# Altium project Control_Board.PrjPcb (part 5 of 7)

## Sheet HB_SENSING.SchDoc
size A4; SheetNumber: 7; SheetTotal: 9
Used 3 times, as channels SEN1, SEN2, SEN3. Parts and nets are listed once, with the designators drawn on the sheet.
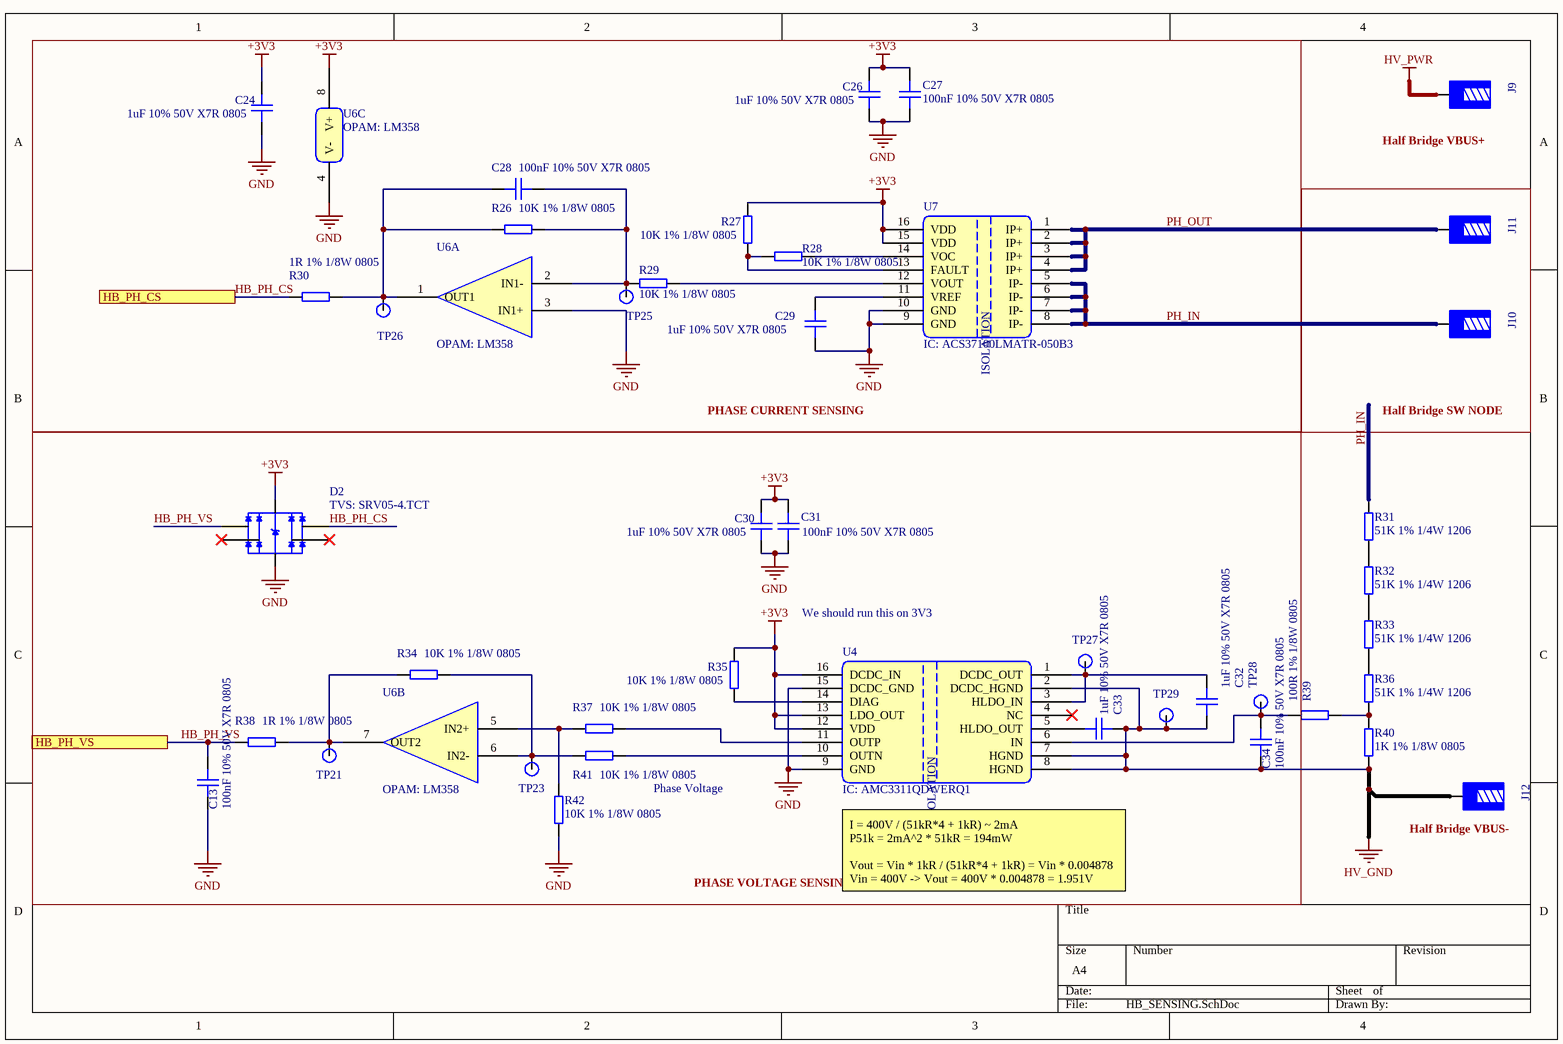
[diagram p5: HB_SENSING.SchDoc]

### Parts
C13  100nF 10% 50V X7R 0805  [CAPC2012X10N]
C24  1uF 10% 50V X7R 0805  [CAPC2012X10N]
C26  1uF 10% 50V X7R 0805  [CAPC2012X10N]
C27  100nF 10% 50V X7R 0805  [CAPC2012X10N]
C28  100nF 10% 50V X7R 0805  [CAPC2012X10N]
C29  1uF 10% 50V X7R 0805  [CAPC2012X10N]
C30  1uF 10% 50V X7R 0805  [CAPC2012X10N]
C31  100nF 10% 50V X7R 0805  [CAPC2012X10N]
C32  1uF 10% 50V X7R 0805  [CAPC2012X10N]
C33  1uF 10% 50V X7R 0805  [CAPC2012X10N]
C34  100nF 10% 50V X7R 0805  [CAPC2012X10N]
D2  TVS: SRV05-4.TCT  [SMTC-SOT23-6_V]
J9  CON1: M5 PCB Terminal  [CON1: M5 PCB Terminal-Footprint-1]  (value not drawn)
J10  CON1: M5 PCB Terminal  [CON1: M5 PCB Terminal-Footprint-1]  (value not drawn)
J11  CON1: M5 PCB Terminal  [CON1: M5 PCB Terminal-Footprint-1]  (value not drawn)
J12  CON1: M5 PCB Terminal  [CON1: M5 PCB Terminal-Footprint-1]  (value not drawn)
R26  10K 1% 1/8W 0805  [RESC2012X05N]
R27  10K 1% 1/8W 0805  [RESC2012X05N]
R28  10K 1% 1/8W 0805  [RESC2012X05N]
R29  10K 1% 1/8W 0805  [RESC2012X05N]
R30  1R 1% 1/8W 0805  [RESC2012X05N]
R31  51K 1% 1/4W 1206  [RESC3116X06N]
R32  51K 1% 1/4W 1206  [RESC3116X06N]
R33  51K 1% 1/4W 1206  [RESC3116X06N]
R34  10K 1% 1/8W 0805  [RESC2012X05N]
R35  10K 1% 1/8W 0805  [RESC2012X05N]
R36  51K 1% 1/4W 1206  [RESC3116X06N]
R37  10K 1% 1/8W 0805  [RESC2012X05N]
R38  1R 1% 1/8W 0805  [RESC2012X05N]
R39  100R 1% 1/8W 0805  [RESC2012X05N]
R40  1K 1% 1/8W 0805  [RESC2012X05N]
R41  10K 1% 1/8W 0805  [RESC2012X05N]
R42  10K 1% 1/8W 0805  [RESC2012X05N]
TP21  TestPoint  [Test Point-Footprint-1]  (value not drawn)
TP23  TestPoint  [Test Point-Footprint-1]  (value not drawn)
TP25  TestPoint  [Test Point-Footprint-1]  (value not drawn)
TP26  TestPoint  [Test Point-Footprint-1]  (value not drawn)
TP27  TestPoint  [Test Point-Footprint-1]  (value not drawn)
TP28  TestPoint  [Test Point-Footprint-1]  (value not drawn)
TP29  TestPoint  [Test Point-Footprint-1]  (value not drawn)
U4  IC: AMC3311QDWERQ1  [SOIC127P1030X265-16N]
U6  OPAM: LM358  [FP-D0008A-IPC_C]  (parts A,B,C of 3)
U7  IC: ACS37100LMATR-050B3  [SOIC127P1030X265-16N]

### Blocks framed on the sheet
PHASE CURRENT SENSING: C24 C26-C29 R26-R30 TP25 TP26 U6 U7
Half Bridge SW NODE: J10 J11

### Ports
HB_PH_CS (see Control_Board_SCH[3C]), HB_PH_VS (see Control_Board_SCH[3C])

### Nets
+3V3: C24.2 C26.2 C27.2 C30.2 C31.2 D2.5 R27.1 R35.1 U4.12(VDD) U4.13(LDO_OUT) U4.16(DCDC_IN) U6.8(V+) U7.15(VDD) U7.16(VDD)
GND: C13.1 C24.1 C26.1 C27.1 C29.1 C30.1 C31.1 D2.2 R42.1 U4.9(GND) U4.15(DCDC_GND) U6.3(IN1+) U6.4(V-) U7.9(GND) U7.10(GND)
HV_GND: C32.1 C33.1 C34.1 J12.1 R40.1 TP29.1 U4.2(DCDC_HGND) U4.7(HGND) U4.8(HGND)
HV_PWR: J9.1
HB_PH_CS: D2.4 R30.1 ; port HB_PH_CS
HB_PH_VS: C13.2 D2.1 R38.1 ; port HB_PH_VS
PH_IN: J10.1 R31.2 U7.5(IP-) U7.6(IP-) U7.7(IP-) U7.8(IP-)
PH_OUT: J11.1 U7.1(IP+) U7.2(IP+) U7.3(IP+) U7.4(IP+)
NetC28_1: C28.1 R26.1 R30.2 TP26.1 U6.1(OUT1)
NetC28_2: C28.2 R26.2 R29.1 TP25.1 U6.2(IN1-)
NetC29_2: C29.2 U7.11(VREF)
NetC32_2: C32.2 TP27.1 U4.1(DCDC_OUT) U4.3(HLDO_IN)
NetC33_2: C33.2 U4.5(HLDO_OUT)
NetC34_2: C34.2 R39.2 TP28.1 U4.6(IN)
NetR27_2: R27.2 R28.1 U7.13(FAULT)
NetR28_2: R28.2 U7.14(VOC)
NetR29_2: R29.2 U7.12(VOUT)
NetR31_1: R31.1 R32.2
NetR32_1: R32.1 R33.2
NetR33_1: R33.1 R36.2
NetR34_1: R34.1 R38.2 TP21.1 U6.7(OUT2)
NetR34_2: R34.2 R41.1 TP23.1 U6.6(IN2-)
NetR35_2: R35.2 U4.14(DIAG)
NetR36_1: R36.1 R39.1 R40.2
NetR37_1: R37.1 R42.2 U6.5(IN2+)
NetR37_2: R37.2 U4.11(OUTP)
NetR41_2: R41.2 U4.10(OUTN)

Not connected (* = marked no-connect by the designer): D2 3* 6*; U4 4(NC)*

### Channels
SEN1: designators end in _SEN1; ports HB_PH_CS=HB_PH_CS HB_PH_VS=HB_PH_VS
SEN2: designators end in _SEN2; ports HB_PH_CS=HB_PH_CS HB_PH_VS=HB_PH_VS
SEN3: designators end in _SEN3; ports HB_PH_CS=HB_PH_CS HB_PH_VS=HB_PH_VS

### Notes on the sheet
- (near C28) Unitary gain
  fc=1/RC = 1kHz
- (near J9) Half Bridge VBUS+
- We should run this on 3V3
- Phase Voltage
- (near J12) Half Bridge VBUS-
- PHASE VOLTAGE SENSING
- (near U4) I = 400V / (51kR*4 + 1kR) ~ 2mA
  P51k = 2mA^2 * 51kR = 194mW
  Vout = Vin * 1kR / (51kR*4 + 1kR) = Vin * 0.004878
  Vin = 400V -> Vout = 400V * 0.004878 = 1.951V
- (in symbol CMP-001-00097-4) ISOLATION
- (in symbol CMP-00248-1) ISOLATION

### Library data of the parts
C13 C27 C28 C31 C34 = CMP-001-00091-1: Multilayer Ceramic Capacitors MLCC - SMD/SMT 50V 0.1uF X7R 0805 10%; Manufacturer: Stackpole Electronics; Manufacturer Part Number: CML0805X7R104KT50V; Voltage Rating (DC): 50V; REACH SVHC: Yes; Height: 800µm; Min Operating Temperature: -55°C; Dielectric Material: Ceramic; RoHS: Compliant; Number of Terminals: 2; Lifecycle Status: Production; Width: 1.25mm; Length: 2mm; Category: Ceramic Capacitors; Max Operating Temperature: 125°C; Mount: Surface Mount; Capacitance: 100nF
C24 C26 C29 C30 C32 C33 = CMP-001-00047-1: Ceramic Capacitor, Multilayer, Ceramic, 50V, 10% +Tol, 10% -Tol, X7R, 15% TC, 1uF, Surface Mount, 0805; Manufacturer Part Number: C2012X7R1H105K125AB; Manufacturer Lifecycle Status: PRODUCTION; Manufacturer: TDK; Value: 1µF; Export Control Classification Number (ECCN) Code: EAR99; Case/Package: 0805; Max Length: 3.5mm; ComponentLink4Description: https://datasheet.octopart.com:443/C3216X7R1H106K160AC-TDK-datasheet-151546523.pdf?src-supplier=ODG+(Origin+Data+Global); ComponentLink1URL: https://datasheet.octopart.com:443/C3216X7R1H106K160AC-TDK-datasheet-175423548.pdf?src-supplier=TME; Category: Ceramic Capacitors; Voltage Rating (DC): 50V; Case Code (Metric): 2012; Lifecycle Status: Production; Height: 1.6mm; Design Item ID: 1uF 10% 50V X7R 0805; Min Length: 3.1mm; Min Operating Temperature: -55°C; Pricing: 100=3,09, 250=2,81, 500=2,35, 1000=2,2, 2000=1,97 (DKK); Width: 1.6mm; Voltage Rating: 50V; Stock: 26276; ComponentLink2Description: https://datasheet.octopart.com:443/C3216X7R1H106K160AC-TDK-datasheet-182135025.pdf?src-supplier=TME; Harmonized Tariff Schedule (HTS) Code: 8532.24.00.20; ComponentLink3Description: https://datasheet.octopart.com:443/C3216X7R1H106K160AC-TDK-datasheet-159617022.pdf?src-supplier=TME; Thickness: 1.6mm; Max Operating Temperature: 125°C; ComponentLink4URL: https://datasheet.octopart.com:443/C3216X7R1H106K160AC-TDK-datasheet-151546523.pdf?src-supplier=ODG+(Origin+Data+Global); Lead Free: Lead Free; ComponentLink3URL: https://datasheet.octopart.com:443/C3216X7R1H106K160AC-TDK-datasheet-159617022.pdf?src-supplier=TME; ComponentLink1Description: https://datasheet.octopart.com:443/C3216X7R1H106K160AC-TDK-datasheet-175423548.pdf?src-supplier=TME; Max Width: 1.9mm; Dielectric: X7R; RoHS: Compliant; China RoHS: Compliant; REACH SVHC: Yes; ComponentLink2URL: https://datasheet.octopart.com:443/C3216X7R1H106K160AC-TDK-datasheet-182135025.pdf?src-supplier=TME; Length: 3.2mm; ComponentLink5URL: https://datasheet.octopart.com/C3216X7R1H106K160AC-TDK-datasheet-41194876.pdf; Introduction Date: 2018-03-29; Dielectric Material: Ceramic; Min Width: 1.5mm; Number of Terminals: 2; Material: Ceramic; Source: MasterLibrary_SCH.SchLib; Mounting Technology: Surface Mount; ComponentLink5Description: https://datasheet.octopart.com/C3216X7R1H106K160AC-TDK-datasheet-41194876.pdf
D2 = CMP-004-00044-2: SRV Series 17.5 V 3 pF SMT RailClamp® Low Capacitance TVS Diode Array SOT-23-6; Manufacturer: Semtech; Max Power Dissipation: 300W; Value: 5pF; Peak Pulse Current: 12A; Polarity: Unidirectional; Breakdown Voltage: 6V; ESD Protection: Yes; Clamping Voltage: 12.5V; Number of Bidirectional Channels: 4; Current: 5A; Test Current: 1mA; Working Voltage: 5V; Leakage Current: 5µA; Number of Elements: 1; Depth: 1.6mm; China RoHS: Compliant; RoHS: Compliant; Lead Free: Lead Free; Pins: 6; Power Rating: 300W; Packaging: Cut Tape; Max Operating Temperature: 125°C; Min Operating Temperature: -55°C; Length: 2.9mm; Case/Package: SOT-23; Lifecycle Status: Production; REACH SVHC: Yes; Peak Pulse Power: 300W; Height: 1.15mm; Max Breakdown Voltage: 6V; Voltage Rating (DC): 5V; Country of Origin: Mainland China; Radiation Hardening: No; Number of Channels: 4; Width: 1.6mm; Operating Supply Voltage: 5V; Min Breakdown Voltage: 6V; Mounting Technology: Surface Mount; Introduction Date: 2002-08-22; Reverse Breakdown Voltage: 6V; Power Line Protection: Yes; Number of Terminals: 6; Max Reverse Leakage Current: 5µA; Reverse Standoff Voltage: 5V; Direction: Unidirectional; Harmonized Tariff Schedule (HTS) Code: 8541.10.00.50; Schedule B: 8542390000, 8542390000; Export Control Classification Number (ECCN) Code: EAR99; Voltage: 5V; Manufacturer Part Number: SRV05-4.TCT
J9-J12 = CMP-002-00581-1: Manufacturer: Lab; Manufacturer Part Number: M5 PCB Terminal
R26-R29 R34 R35 R37 R41 R42 = CMP-009-00659-2: Res Thick Film 0805 10K Ohm 1% 0.125W ±100ppm/°C Molded SMD Paper T/R; Manufacturer: Stackpole Electronics; Manufacturer Part Number: RMCF0805FT10K0; Power Dissipation: 125mW; Voltage Rating: 150V; Design Item ID: 10K 1% 1/4W 0805; ComponentLink15URL: http://sigma.octopart.com:80/15940719/materials_sheet/Stackpole-Electronics-RMCF0805FT10K0.pdf?src-supplier=Compliance+Statements; ComponentLink13Description: https://datasheet.octopart.com:443/RMCF0805FT10K0-Stackpole-Electronics-datasheet-8088878.pdf?src-supplier=Future+Electronics; Depth: 1.25mm; Number of Terminations: 2; ComponentLink12Description: https://datasheet.octopart.com:443/RMCF0805FT10K0-Stackpole-Electronics-datasheet-8324226.pdf?src-supplier=Future+Electronics; ComponentLink9URL: https://datasheet.octopart.com:443/RMCF0805FT10K0-Stackpole-Electronics-datasheet-11546843.pdf?src-supplier=Arrow+Electronics; ComponentLink4Description: https://datasheet.octopart.com:443/RMCF0805FT10K0-Stackpole-Electronics-datasheet-12510902.pdf?src-supplier=Upverter; China RoHS: Non-Compliant; Contact Plating: Tin; ComponentLink7URL: https://datasheet.octopart.com:443/RMCF0805FT10K0-Stackpole-Electronics-datasheet-10788263.pdf?src-supplier=Stackpole+Electronics; ComponentLink6Description: https://datasheet.octopart.com:443/RMCF0805FT10K0-Stackpole-Electronics-datasheet-62091608.pdf?src-supplier=Stackpole+Electronics; ComponentLink4URL: https://datasheet.octopart.com:443/RMCF0805FT10K0-Stackpole-Electronics-datasheet-12510902.pdf?src-supplier=Upverter; ComponentLink12URL: https://datasheet.octopart.com:443/RMCF0805FT10K0-Stackpole-Electronics-datasheet-8324226.pdf?src-supplier=Future+Electronics; ComponentLink1Description: https://datasheet.octopart.com:443/RMCF0805FT10K0-Stackpole-Electronics-datasheet-182148065.pdf?src-supplier=IHS; ComponentLink3URL: https://datasheet.octopart.com:443/RMCF0805FT10K0-Stackpole-Electronics-datasheet-28504820.pdf?src-supplier=Upverter; Width: 1.25mm; Lifecycle Status: Production; ComponentLink15Description: http://sigma.octopart.com:80/15940719/materials_sheet/Stackpole-Electronics-RMCF0805FT10K0.pdf?src-supplier=Compliance+Statements; Max Operating Temperature: 155°C; ComponentLink8URL: https://datasheet.octopart.com:443/RMCF0805FT10K0-Stackpole-Electronics-datasheet-154799224.pdf?src-supplier=Master+Electronics; ComponentLink16URL: http://sigma.octopart.com:80/141158211/reach_statement/Stackpole-Electronics-RMCF0805FT10K0.pdf?src-supplier=Compliance+Statements; ComponentLink3Description: https://datasheet.octopart.com:443/RMCF0805FT10K0-Stackpole-Electronics-datasheet-28504820.pdf?src-supplier=Upverter; ComponentLink10URL: https://datasheet.octopart.com:443/RMCF0805FT10K0-Stackpole-Electronics-datasheet-11547379.pdf?src-supplier=Future+Electronics; Features: Automotive AEC-Q200; Lead Free: Lead Free; ComponentLink2Description: https://datasheet.octopart.com:443/RMCF0805FT10K0-Stackpole-Electronics-datasheet-12534581.pdf?src-supplier=Upverter; ComponentLink14Description: https://datasheet.octopart.com:443/RMCF0805FT10K0-Stackpole-Electronics-datasheet-5313682.pdf?src-supplier=Future+Electronics; ComponentLink17URL: http://sigma.octopart.com:80/141158212/rohs_statement/Stackpole-Electronics-RMCF0805FT10K0.pdf?src-supplier=Compliance+Statements; Stock: 3420000; ComponentLink5URL: https://datasheet.octopart.com:443/RMCF0805FT10K0-Stackpole-Electronics-datasheet-141193804.pdf?src-supplier=Stackpole+Electronics; ComponentLink11URL: https://datasheet.octopart.com:443/RMCF0805FT10K0-Stackpole-Electronics-datasheet-8359789.pdf?src-supplier=Future+Electronics; Max Power Dissipation: 125mW; ComponentLink10Description: https://datasheet.octopart.com:443/RMCF0805FT10K0-Stackpole-Electronics-datasheet-11547379.pdf?src-supplier=Future+Electronics; Case/Package: 0805; ComponentLink8Description: https://datasheet.octopart.com:443/RMCF0805FT10K0-Stackpole-Electronics-datasheet-154799224.pdf?src-supplier=Master+Electronics; Schedule B: 8533210045, 8533210045; Composition: Thick Film; RoHS: Compliant; ComponentLink17Description: http://sigma.octopart.com:80/141158212/rohs_statement/Stackpole-Electronics-RMCF0805FT10K0.pdf?src-supplier=Compliance+Statements; Case Code (Metric): 2012; Number of Terminals: 2; Military Standard: Not; ComponentLink11Description: https://datasheet.octopart.com:443/RMCF0805FT10K0-Stackpole-Electronics-datasheet-8359789.pdf?src-supplier=Future+Electronics; Height: 500µm; Min Operating Temperature: -55°C; Category: Chip SMD Resistors; Value: 10k; Working Voltage: 150V; Source: MasterLibrary_SCH.SchLib; ComponentLink5Description: https://datasheet.octopart.com:443/RMCF0805FT10K0-Stackpole-Electronics-datasheet-141193804.pdf?src-supplier=Stackpole+Electronics; Length: 2mm; ComponentLink16Description: http://sigma.octopart.com:80/141158211/reach_statement/Stackpole-Electronics-RMCF0805FT10K0.pdf?src-supplier=Compliance+Statements; Tolerance: 1%; Temperature Coefficient: 100ppm/°C; Pricing: 5000=0.00245, 10000=0.00241, 20000=0.00238, 40000=0.00234, 80000=0.0023 (USD); REACH SVHC: Yes; Mounting Technology: Surface Mount; Packaging: Cut Tape (CT); ComponentLink9Description: https://datasheet.octopart.com:443/RMCF0805FT10K0-Stackpole-Electronics-datasheet-11546843.pdf?src-supplier=Arrow+Electronics; Power Rating: 125mW; ComponentLink13URL: https://datasheet.octopart.com:443/RMCF0805FT10K0-Stackpole-Electronics-datasheet-8088878.pdf?src-supplier=Future+Electronics; ComponentLink2URL: https://datasheet.octopart.com:443/RMCF0805FT10K0-Stackpole-Electronics-datasheet-12534581.pdf?src-supplier=Upverter; ComponentLink1URL: https://datasheet.octopart.com:443/RMCF0805FT10K0-Stackpole-Electronics-datasheet-182148065.pdf?src-supplier=IHS; ComponentLink7Description: https://datasheet.octopart.com:443/RMCF0805FT10K0-Stackpole-Electronics-datasheet-10788263.pdf?src-supplier=Stackpole+Electronics; Radiation Hardening: No; ComponentLink6URL: https://datasheet.octopart.com:443/RMCF0805FT10K0-Stackpole-Electronics-datasheet-62091608.pdf?src-supplier=Stackpole+Electronics; ComponentLink14URL: https://datasheet.octopart.com:443/RMCF0805FT10K0-Stackpole-Electronics-datasheet-5313682.pdf?src-supplier=Future+Electronics
R30 R38 = CMP-009-00658-1: Res Thick Film 0805 1 Ohm 1% 0.125W ±100ppm/°C Molded SMD Paper T/R; Manufacturer Part Number: RMCF0805FT1R00; Manufacturer: Stackpole Electronics; Voltage Rating: 150V; Max Power Dissipation: 125mW; Value: 1; RoHS: Compliant; ComponentLink13URL: https://datasheet.octopart.com:443/RMCF0805FT10K0-Stackpole-Electronics-datasheet-8088878.pdf?src-supplier=Future+Electronics; Number of Terminations: 2; ComponentLink11URL: https://datasheet.octopart.com:443/RMCF0805FT10K0-Stackpole-Electronics-datasheet-8359789.pdf?src-supplier=Future+Electronics; Case Code (Metric): 2012; Min Operating Temperature: -55°C; ComponentLink2URL: https://datasheet.octopart.com:443/RMCF0805FT10K0-Stackpole-Electronics-datasheet-12534581.pdf?src-supplier=Upverter; ComponentLink14Description: https://datasheet.octopart.com:443/RMCF0805FT10K0-Stackpole-Electronics-datasheet-5313682.pdf?src-supplier=Future+Electronics; Pricing: 5000=0.00245, 10000=0.00241, 20000=0.00238, 40000=0.00234, 80000=0.0023 (USD); Composition: Thick Film; Category: Chip SMD Resistors; Military Standard: Not; Lead Free: Lead Free; ComponentLink17Description: http://sigma.octopart.com:80/141158212/rohs_statement/Stackpole-Electronics-RMCF0805FT10K0.pdf?src-supplier=Compliance+Statements; Height: 500µm; ComponentLink3URL: https://datasheet.octopart.com:443/RMCF0805FT10K0-Stackpole-Electronics-datasheet-28504820.pdf?src-supplier=Upverter; ComponentLink4URL: https://datasheet.octopart.com:443/RMCF0805FT10K0-Stackpole-Electronics-datasheet-12510902.pdf?src-supplier=Upverter; Stock: 3420000; ComponentLink5Description: https://datasheet.octopart.com:443/RMCF0805FT10K0-Stackpole-Electronics-datasheet-141193804.pdf?src-supplier=Stackpole+Electronics; ComponentLink16Description: http://sigma.octopart.com:80/141158211/reach_statement/Stackpole-Electronics-RMCF0805FT10K0.pdf?src-supplier=Compliance+Statements; Mounting Technology: Surface Mount; ComponentLink9URL: https://datasheet.octopart.com:443/RMCF0805FT10K0-Stackpole-Electronics-datasheet-11546843.pdf?src-supplier=Arrow+Electronics; Lifecycle Status: Production; Schedule B: 8533210045, 8533210045; ComponentLink1URL: https://datasheet.octopart.com:443/RMCF0805FT10K0-Stackpole-Electronics-datasheet-182148065.pdf?src-supplier=IHS; Length: 2mm; ComponentLink14URL: https://datasheet.octopart.com:443/RMCF0805FT10K0-Stackpole-Electronics-datasheet-5313682.pdf?src-supplier=Future+Electronics; ComponentLink4Description: https://datasheet.octopart.com:443/RMCF0805FT10K0-Stackpole-Electronics-datasheet-12510902.pdf?src-supplier=Upverter; ComponentLink11Description: https://datasheet.octopart.com:443/RMCF0805FT10K0-Stackpole-Electronics-datasheet-8359789.pdf?src-supplier=Future+Electronics; ComponentLink8Description: https://datasheet.octopart.com:443/RMCF0805FT10K0-Stackpole-Electronics-datasheet-154799224.pdf?src-supplier=Master+Electronics; Number of Terminals: 2; ComponentLink13Description: https://datasheet.octopart.com:443/RMCF0805FT10K0-Stackpole-Electronics-datasheet-8088878.pdf?src-supplier=Future+Electronics; Packaging: Cut Tape (CT); Power Rating: 125mW; ComponentLink17URL: http://sigma.octopart.com:80/141158212/rohs_statement/Stackpole-Electronics-RMCF0805FT10K0.pdf?src-supplier=Compliance+Statements; ComponentLink10Description: https://datasheet.octopart.com:443/RMCF0805FT10K0-Stackpole-Electronics-datasheet-11547379.pdf?src-supplier=Future+Electronics; ComponentLink6URL: https://datasheet.octopart.com:443/RMCF0805FT10K0-Stackpole-Electronics-datasheet-62091608.pdf?src-supplier=Stackpole+Electronics; ComponentLink16URL: http://sigma.octopart.com:80/141158211/reach_statement/Stackpole-Electronics-RMCF0805FT10K0.pdf?src-supplier=Compliance+Statements; ComponentLink15Description: http://sigma.octopart.com:80/15940719/materials_sheet/Stackpole-Electronics-RMCF0805FT10K0.pdf?src-supplier=Compliance+Statements; China RoHS: Non-Compliant; ComponentLink6Description: https://datasheet.octopart.com:443/RMCF0805FT10K0-Stackpole-Electronics-datasheet-62091608.pdf?src-supplier=Stackpole+Electronics; ComponentLink8URL: https://datasheet.octopart.com:443/RMCF0805FT10K0-Stackpole-Electronics-datasheet-154799224.pdf?src-supplier=Master+Electronics; Working Voltage: 150V; ComponentLink5URL: https://datasheet.octopart.com:443/RMCF0805FT10K0-Stackpole-Electronics-datasheet-141193804.pdf?src-supplier=Stackpole+Electronics; Case/Package: 0805; ComponentLink15URL: http://sigma.octopart.com:80/15940719/materials_sheet/Stackpole-Electronics-RMCF0805FT10K0.pdf?src-supplier=Compliance+Statements; Power Dissipation: 125mW; ComponentLink7URL: https://datasheet.octopart.com:443/RMCF0805FT10K0-Stackpole-Electronics-datasheet-10788263.pdf?src-supplier=Stackpole+Electronics; REACH SVHC: Yes; ComponentLink1Description: https://datasheet.octopart.com:443/RMCF0805FT10K0-Stackpole-Electronics-datasheet-182148065.pdf?src-supplier=IHS; Source: MasterLibrary_SCH.SchLib; Radiation Hardening: No; ComponentLink3Description: https://datasheet.octopart.com:443/RMCF0805FT10K0-Stackpole-Electronics-datasheet-28504820.pdf?src-supplier=Upverter; Contact Plating: Tin; ComponentLink12URL: https://datasheet.octopart.com:443/RMCF0805FT10K0-Stackpole-Electronics-datasheet-8324226.pdf?src-supplier=Future+Electronics; ComponentLink10URL: https://datasheet.octopart.com:443/RMCF0805FT10K0-Stackpole-Electronics-datasheet-11547379.pdf?src-supplier=Future+Electronics; Max Operating Temperature: 155°C; ComponentLink9Description: https://datasheet.octopart.com:443/RMCF0805FT10K0-Stackpole-Electronics-datasheet-11546843.pdf?src-supplier=Arrow+Electronics; Temperature Coefficient: 100ppm/°C; Width: 1.25mm; Depth: 1.25mm; Tolerance: 1%; ComponentLink12Description: https://datasheet.octopart.com:443/RMCF0805FT10K0-Stackpole-Electronics-datasheet-8324226.pdf?src-supplier=Future+Electronics; Design Item ID: 1R 1% 1/8W 0805; ComponentLink7Description: https://datasheet.octopart.com:443/RMCF0805FT10K0-Stackpole-Electronics-datasheet-10788263.pdf?src-supplier=Stackpole+Electronics; ComponentLink2Description: https://datasheet.octopart.com:443/RMCF0805FT10K0-Stackpole-Electronics-datasheet-12534581.pdf?src-supplier=Upverter; Features: Automotive AEC-Q200
R31-R33 R36 = CMP-009-00669-2: Res Thick Film 1206 51K Ohm 1% 0.25W(1/4W) ±100ppm/C Pad SMD T/R Automotive AEC-Q200; Manufacturer: Stackpole Electronics; Manufacturer Part Number: RMCF1206JT51K0; Power Rating: 250mW; Temperature Coefficient: 100ppm/°C; Tolerance: 5%; Resistance: 51kΩ; Packaging: Cut Tape (CT); Number of Terminations: 2; China RoHS: Non-Compliant; Max Operating Temperature: 155°C; Lifecycle Status: Production; Length: 3.2004mm; RoHS: Compliant; Features: Automotive AEC-Q200; Military Standard: Not; Contact Plating: Tin; REACH SVHC: Yes; Case Code (Metric): 3216; Composition: Thick Film; Category: Chip SMD Resistors; Radiation Hardening: No; Case/Package: 1206; Depth: 1.6mm; Number of Terminals: 2; Height: 550µm; Power Dissipation: 250mW; Max Power Dissipation: 250mW; Min Operating Temperature: -55°C; Schedule B: 8533210045, 8533210045; Case Code (Imperial): 1206; Mount: Surface Mount; Country of Origin: Japan, Mainland China, Taiwan; Introduction Date: 2011-01-07; Export Control Classification Number (ECCN) Code: EAR99; Harmonized Tariff Schedule (HTS) Code: 8533.21.00.30
R39 = CMP-009-00668-1: Res Thick Film 0805 100 Ohm 1% 0.125W ±100ppm/°C Molded SMD Paper T/R; Manufacturer Part Number: RMCF0805FT100R; Manufacturer: Stackpole Electronics; Working Voltage: 150V; Power Rating: 125mW; Value: 100; Features: Automotive AEC-Q200; Lifecycle Status: Production; ComponentLink10URL: https://datasheet.octopart.com:443/RMCF0805FT10K0-Stackpole-Electronics-datasheet-11547379.pdf?src-supplier=Future+Electronics; Case Code (Metric): 2012; ComponentLink16URL: http://sigma.octopart.com:80/141158211/reach_statement/Stackpole-Electronics-RMCF0805FT10K0.pdf?src-supplier=Compliance+Statements; ComponentLink14URL: https://datasheet.octopart.com:443/RMCF0805FT10K0-Stackpole-Electronics-datasheet-5313682.pdf?src-supplier=Future+Electronics; ComponentLink6URL: https://datasheet.octopart.com:443/RMCF0805FT10K0-Stackpole-Electronics-datasheet-62091608.pdf?src-supplier=Stackpole+Electronics; ComponentLink3URL: https://datasheet.octopart.com:443/RMCF0805FT10K0-Stackpole-Electronics-datasheet-28504820.pdf?src-supplier=Upverter; Design Item ID: 100R 1% 1/8W 0805; Mounting Technology: Surface Mount; ComponentLink9URL: https://datasheet.octopart.com:443/RMCF0805FT10K0-Stackpole-Electronics-datasheet-11546843.pdf?src-supplier=Arrow+Electronics; ComponentLink2Description: https://datasheet.octopart.com:443/RMCF0805FT10K0-Stackpole-Electronics-datasheet-12534581.pdf?src-supplier=Upverter; Voltage Rating: 150V; ComponentLink17Description: http://sigma.octopart.com:80/141158212/rohs_statement/Stackpole-Electronics-RMCF0805FT10K0.pdf?src-supplier=Compliance+Statements; Stock: 3420000; Number of Terminations: 2; Contact Plating: Tin; ComponentLink1Description: https://datasheet.octopart.com:443/RMCF0805FT10K0-Stackpole-Electronics-datasheet-182148065.pdf?src-supplier=IHS; ComponentLink2URL: https://datasheet.octopart.com:443/RMCF0805FT10K0-Stackpole-Electronics-datasheet-12534581.pdf?src-supplier=Upverter; Source: MasterLibrary_SCH.SchLib; Length: 2mm; ComponentLink13Description: https://datasheet.octopart.com:443/RMCF0805FT10K0-Stackpole-Electronics-datasheet-8088878.pdf?src-supplier=Future+Electronics; Lead Free: Lead Free; Category: Chip SMD Resistors; Composition: Thick Film; Tolerance: 1%; Schedule B: 8533210045, 8533210045; RoHS: Compliant; ComponentLink15URL: http://sigma.octopart.com:80/15940719/materials_sheet/Stackpole-Electronics-RMCF0805FT10K0.pdf?src-supplier=Compliance+Statements; Case/Package: 0805; Pricing: 5000=0.00245, 10000=0.00241, 20000=0.00238, 40000=0.00234, 80000=0.0023 (USD); ComponentLink8Description: https://datasheet.octopart.com:443/RMCF0805FT10K0-Stackpole-Electronics-datasheet-154799224.pdf?src-supplier=Master+Electronics; ComponentLink11Description: https://datasheet.octopart.com:443/RMCF0805FT10K0-Stackpole-Electronics-datasheet-8359789.pdf?src-supplier=Future+Electronics; China RoHS: Non-Compliant; Height: 500µm; ComponentLink9Description: https://datasheet.octopart.com:443/RMCF0805FT10K0-Stackpole-Electronics-datasheet-11546843.pdf?src-supplier=Arrow+Electronics; ComponentLink8URL: https://datasheet.octopart.com:443/RMCF0805FT10K0-Stackpole-Electronics-datasheet-154799224.pdf?src-supplier=Master+Electronics; ComponentLink12Description: https://datasheet.octopart.com:443/RMCF0805FT10K0-Stackpole-Electronics-datasheet-8324226.pdf?src-supplier=Future+Electronics; Temperature Coefficient: 100ppm/°C; ComponentLink12URL: https://datasheet.octopart.com:443/RMCF0805FT10K0-Stackpole-Electronics-datasheet-8324226.pdf?src-supplier=Future+Electronics; Number of Terminals: 2; Depth: 1.25mm; ComponentLink7Description: https://datasheet.octopart.com:443/RMCF0805FT10K0-Stackpole-Electronics-datasheet-10788263.pdf?src-supplier=Stackpole+Electronics; ComponentLink15Description: http://sigma.octopart.com:80/15940719/materials_sheet/Stackpole-Electronics-RMCF0805FT10K0.pdf?src-supplier=Compliance+Statements; ComponentLink6Description: https://datasheet.octopart.com:443/RMCF0805FT10K0-Stackpole-Electronics-datasheet-62091608.pdf?src-supplier=Stackpole+Electronics; Packaging: Cut Tape (CT); Max Operating Temperature: 155°C; ComponentLink7URL: https://datasheet.octopart.com:443/RMCF0805FT10K0-Stackpole-Electronics-datasheet-10788263.pdf?src-supplier=Stackpole+Electronics; ComponentLink16Description: http://sigma.octopart.com:80/141158211/reach_statement/Stackpole-Electronics-RMCF0805FT10K0.pdf?src-supplier=Compliance+Statements; Width: 1.25mm; Power Dissipation: 125mW; ComponentLink5Description: https://datasheet.octopart.com:443/RMCF0805FT10K0-Stackpole-Electronics-datasheet-141193804.pdf?src-supplier=Stackpole+Electronics; Radiation Hardening: No; Military Standard: Not; Min Operating Temperature: -55°C; ComponentLink11URL: https://datasheet.octopart.com:443/RMCF0805FT10K0-Stackpole-Electronics-datasheet-8359789.pdf?src-supplier=Future+Electronics; ComponentLink3Description: https://datasheet.octopart.com:443/RMCF0805FT10K0-Stackpole-Electronics-datasheet-28504820.pdf?src-supplier=Upverter; REACH SVHC: Yes; ComponentLink4Description: https://datasheet.octopart.com:443/RMCF0805FT10K0-Stackpole-Electronics-datasheet-12510902.pdf?src-supplier=Upverter; ComponentLink10Description: https://datasheet.octopart.com:443/RMCF0805FT10K0-Stackpole-Electronics-datasheet-11547379.pdf?src-supplier=Future+Electronics; ComponentLink5URL: https://datasheet.octopart.com:443/RMCF0805FT10K0-Stackpole-Electronics-datasheet-141193804.pdf?src-supplier=Stackpole+Electronics; Max Power Dissipation: 125mW; ComponentLink13URL: https://datasheet.octopart.com:443/RMCF0805FT10K0-Stackpole-Electronics-datasheet-8088878.pdf?src-supplier=Future+Electronics; ComponentLink17URL: http://sigma.octopart.com:80/141158212/rohs_statement/Stackpole-Electronics-RMCF0805FT10K0.pdf?src-supplier=Compliance+Statements; ComponentLink14Description: https://datasheet.octopart.com:443/RMCF0805FT10K0-Stackpole-Electronics-datasheet-5313682.pdf?src-supplier=Future+Electronics; ComponentLink4URL: https://datasheet.octopart.com:443/RMCF0805FT10K0-Stackpole-Electronics-datasheet-12510902.pdf?src-supplier=Upverter; ComponentLink1URL: https://datasheet.octopart.com:443/RMCF0805FT10K0-Stackpole-Electronics-datasheet-182148065.pdf?src-supplier=IHS
R40 = CMP-009-00648-1: Res Thick Film 0805 1K Ohm 1% 0.125W ±100ppm/°C Molded SMD Paper T/R; Manufacturer: Stackpole Electronics; Manufacturer Part Number: RMCF0805FT1K00; Power Dissipation: 125mW; Working Voltage: 150V; ComponentLink4Description: https://datasheet.octopart.com:443/RMCF0805FT10K0-Stackpole-Electronics-datasheet-12510902.pdf?src-supplier=Upverter; Tolerance: 1%; ComponentLink7Description: https://datasheet.octopart.com:443/RMCF0805FT10K0-Stackpole-Electronics-datasheet-10788263.pdf?src-supplier=Stackpole+Electronics; Category: Chip SMD Resistors; Pricing: 5000=0.00245, 10000=0.00241, 20000=0.00238, 40000=0.00234, 80000=0.0023 (USD); RoHS: Compliant; Packaging: Cut Tape (CT); Width: 1.25mm; ComponentLink12URL: https://datasheet.octopart.com:443/RMCF0805FT10K0-Stackpole-Electronics-datasheet-8324226.pdf?src-supplier=Future+Electronics; Temperature Coefficient: 100ppm/°C; Lifecycle Status: Production; Mounting Technology: Surface Mount; ComponentLink6Description: https://datasheet.octopart.com:443/RMCF0805FT10K0-Stackpole-Electronics-datasheet-62091608.pdf?src-supplier=Stackpole+Electronics; Number of Terminals: 2; ComponentLink1Description: https://datasheet.octopart.com:443/RMCF0805FT10K0-Stackpole-Electronics-datasheet-182148065.pdf?src-supplier=IHS; REACH SVHC: Yes; ComponentLink4URL: https://datasheet.octopart.com:443/RMCF0805FT10K0-Stackpole-Electronics-datasheet-12510902.pdf?src-supplier=Upverter; Power Rating: 125mW; Value: 1k; ComponentLink13URL: https://datasheet.octopart.com:443/RMCF0805FT10K0-Stackpole-Electronics-datasheet-8088878.pdf?src-supplier=Future+Electronics; ComponentLink10Description: https://datasheet.octopart.com:443/RMCF0805FT10K0-Stackpole-Electronics-datasheet-11547379.pdf?src-supplier=Future+Electronics; ComponentLink12Description: https://datasheet.octopart.com:443/RMCF0805FT10K0-Stackpole-Electronics-datasheet-8324226.pdf?src-supplier=Future+Electronics; ComponentLink2Description: https://datasheet.octopart.com:443/RMCF0805FT10K0-Stackpole-Electronics-datasheet-12534581.pdf?src-supplier=Upverter; Number of Terminations: 2; ComponentLink17URL: http://sigma.octopart.com:80/141158212/rohs_statement/Stackpole-Electronics-RMCF0805FT10K0.pdf?src-supplier=Compliance+Statements; Contact Plating: Tin; ComponentLink9URL: https://datasheet.octopart.com:443/RMCF0805FT10K0-Stackpole-Electronics-datasheet-11546843.pdf?src-supplier=Arrow+Electronics; ComponentLink17Description: http://sigma.octopart.com:80/141158212/rohs_statement/Stackpole-Electronics-RMCF0805FT10K0.pdf?src-supplier=Compliance+Statements; ComponentLink2URL: https://datasheet.octopart.com:443/RMCF0805FT10K0-Stackpole-Electronics-datasheet-12534581.pdf?src-supplier=Upverter; Case Code (Metric): 2012; ComponentLink8Description: https://datasheet.octopart.com:443/RMCF0805FT10K0-Stackpole-Electronics-datasheet-154799224.pdf?src-supplier=Master+Electronics; ComponentLink11Description: https://datasheet.octopart.com:443/RMCF0805FT10K0-Stackpole-Electronics-datasheet-8359789.pdf?src-supplier=Future+Electronics; ComponentLink5Description: https://datasheet.octopart.com:443/RMCF0805FT10K0-Stackpole-Electronics-datasheet-141193804.pdf?src-supplier=Stackpole+Electronics; ComponentLink11URL: https://datasheet.octopart.com:443/RMCF0805FT10K0-Stackpole-Electronics-datasheet-8359789.pdf?src-supplier=Future+Electronics; Height: 500µm; ComponentLink1URL: https://datasheet.octopart.com:443/RMCF0805FT10K0-Stackpole-Electronics-datasheet-182148065.pdf?src-supplier=IHS; Length: 2mm; ComponentLink16Description: http://sigma.octopart.com:80/141158211/reach_statement/Stackpole-Electronics-RMCF0805FT10K0.pdf?src-supplier=Compliance+Statements; ComponentLink6URL: https://datasheet.octopart.com:443/RMCF0805FT10K0-Stackpole-Electronics-datasheet-62091608.pdf?src-supplier=Stackpole+Electronics; Schedule B: 8533210045, 8533210045; ComponentLink14URL: https://datasheet.octopart.com:443/RMCF0805FT10K0-Stackpole-Electronics-datasheet-5313682.pdf?src-supplier=Future+Electronics; Stock: 3420000; ComponentLink14Description: https://datasheet.octopart.com:443/RMCF0805FT10K0-Stackpole-Electronics-datasheet-5313682.pdf?src-supplier=Future+Electronics; Features: Automotive AEC-Q200; China RoHS: Non-Compliant; ComponentLink13Description: https://datasheet.octopart.com:443/RMCF0805FT10K0-Stackpole-Electronics-datasheet-8088878.pdf?src-supplier=Future+Electronics; Voltage Rating: 150V; Radiation Hardening: No; Source: MasterLibrary_SCH.SchLib; ComponentLink8URL: https://datasheet.octopart.com:443/RMCF0805FT10K0-Stackpole-Electronics-datasheet-154799224.pdf?src-supplier=Master+Electronics; Max Operating Temperature: 155°C; Design Item ID: 1K 1% 1/8W 0805; ComponentLink15Description: http://sigma.octopart.com:80/15940719/materials_sheet/Stackpole-Electronics-RMCF0805FT10K0.pdf?src-supplier=Compliance+Statements; ComponentLink5URL: https://datasheet.octopart.com:443/RMCF0805FT10K0-Stackpole-Electronics-datasheet-141193804.pdf?src-supplier=Stackpole+Electronics; ComponentLink15URL: http://sigma.octopart.com:80/15940719/materials_sheet/Stackpole-Electronics-RMCF0805FT10K0.pdf?src-supplier=Compliance+Statements; Lead Free: Lead Free; Case/Package: 0805; Max Power Dissipation: 125mW; ComponentLink10URL: https://datasheet.octopart.com:443/RMCF0805FT10K0-Stackpole-Electronics-datasheet-11547379.pdf?src-supplier=Future+Electronics; ComponentLink7URL: https://datasheet.octopart.com:443/RMCF0805FT10K0-Stackpole-Electronics-datasheet-10788263.pdf?src-supplier=Stackpole+Electronics; Min Operating Temperature: -55°C; ComponentLink9Description: https://datasheet.octopart.com:443/RMCF0805FT10K0-Stackpole-Electronics-datasheet-11546843.pdf?src-supplier=Arrow+Electronics; Depth: 1.25mm; Military Standard: Not; ComponentLink16URL: http://sigma.octopart.com:80/141158211/reach_statement/Stackpole-Electronics-RMCF0805FT10K0.pdf?src-supplier=Compliance+Statements; ComponentLink3URL: https://datasheet.octopart.com:443/RMCF0805FT10K0-Stackpole-Electronics-datasheet-28504820.pdf?src-supplier=Upverter; ComponentLink3Description: https://datasheet.octopart.com:443/RMCF0805FT10K0-Stackpole-Electronics-datasheet-28504820.pdf?src-supplier=Upverter; Composition: Thick Film
TP21 TP23 TP25-TP29 = CMP-002-00584-1
U4 = CMP-001-00097-4: Automotive, 0 to 2-V input, precision reinforced isolated amplifier with integrated DC/DC converter 16-SOIC -40 to 125; Manufacturer: Texas Instruments; Manufacturer Lifecycle Status: ACTIVE; Input Bias Current: 3.5nA; Number of Channels: 1; Input Offset Voltage (Vos): 100µV; Min Supply Voltage: 3V; Output Current per Channel: 14mA; Response Time: 600µs; Bandwidth: 275kHz; Max Junction Temperature (Tj): 150°C; Max Supply Voltage: 5.5V; Category: Linear ICs; Number of Pins: 16; Width: 7.5mm; Thickness: 2.35mm; Length: 10.3mm; Height: 2.65mm; Min Operating Temperature: -40°C; Lifecycle Status: Production; Max Operating Temperature: 125°C; RoHS: Compliant; Manufacturer Part Number: AMC3311QDWERQ1; Ambient Temperature Range High: 125°C; Pins: 16
U6 = CMP-001-00098-1: Dual, 30-V, 700-kHz, 3-mV offset voltage operational amplifier 8-SOIC 0 to 70; Manufacturer: Texas Instruments; Manufacturer Lifecycle Status: ACTIVE; Manufacturer Part Number: LM358BAIDR; Max Dual Supply Voltage: 15V; Voltage Gain: 100dB; Number of Elements: 2; Response Time: 4µs; Gain Bandwidth Product: 700kHz; Max Supply Voltage: 30V; Operating Supply Current: 1mA; Bandwidth: 1.2MHz; Common Mode Rejection Ratio: 65dB; Slew Rate: 0.3V/µs; Operating Supply Voltage: 16V; Input Offset Voltage (Vos): 2mV; Output Current per Channel: -60mA; Max Junction Temperature (Tj): 150°C; Output Current: 30mA; Dual Supply Voltage: 9V; Min Dual Supply Voltage: 1.5V; Input Bias Current: -15nA; Nominal Supply Current: 350µA; Min Supply Voltage: 3V; Pins: 8; Mounting Technology: Surface Mount; RoHS: Compliant; Number of Channels: 2; Lead Free: Lead Free; Number of Circuits: 2; Packaging: Tape & Reel; Thickness: 1.58mm; Schedule B: 8542330000, 8542330000; Lifecycle Status: Production; Case/Package: SOIC; Height: 1.75mm; Number of Amplifiers: 2; Number of Pins: 8; Max Operating Temperature: 70°C; REACH SVHC: No; Ambient Temperature Range High: 70°C; Category: Amplifiers - Op Amps, Buffer, Instrumentation; Width: 3.91mm; Min Operating Temperature: 0°C; Radiation Hardening: No; Length: 4.9mm; PartId: 1
U7 = CMP-00248-1: Magnetoresistive Sensor; Manufacturer: Allegro MicroSystems; Category: Sensors; Manufacturer Part Number: ACS37100LMATR-050B3; Lifecycle Status: Production